# EAGLE schematic SzineszFeny_2mm_V12 (EAGLE 7.5.0)
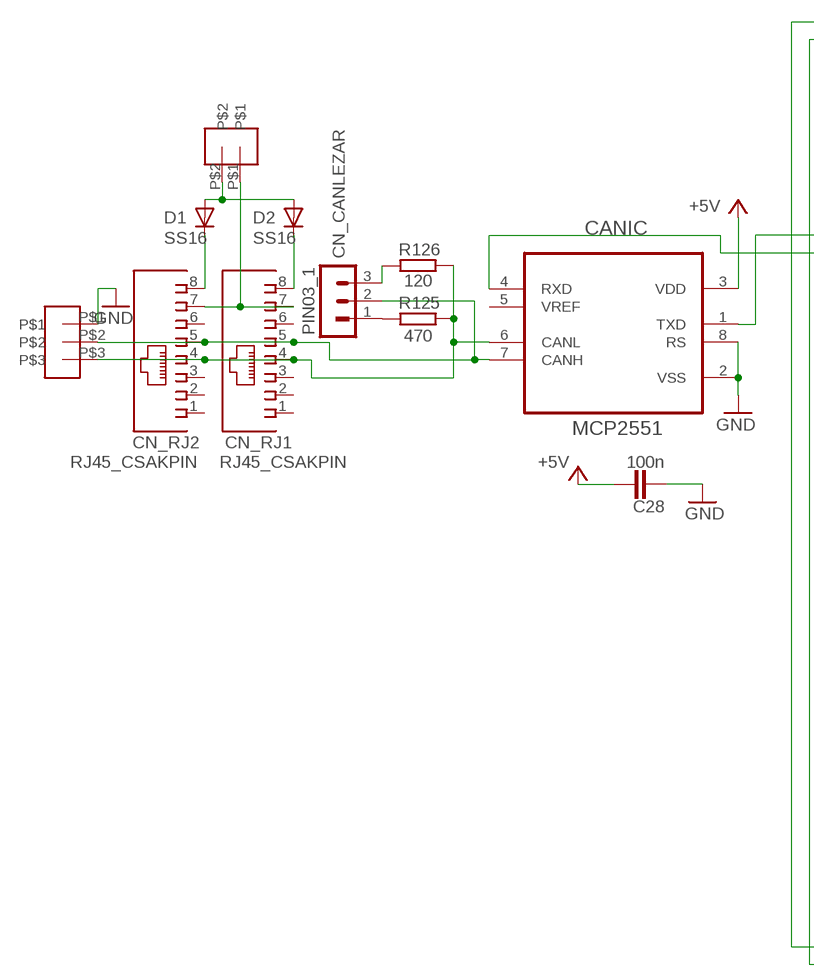
[diagram p0: schematic, sheet 1, part 1 of 2]
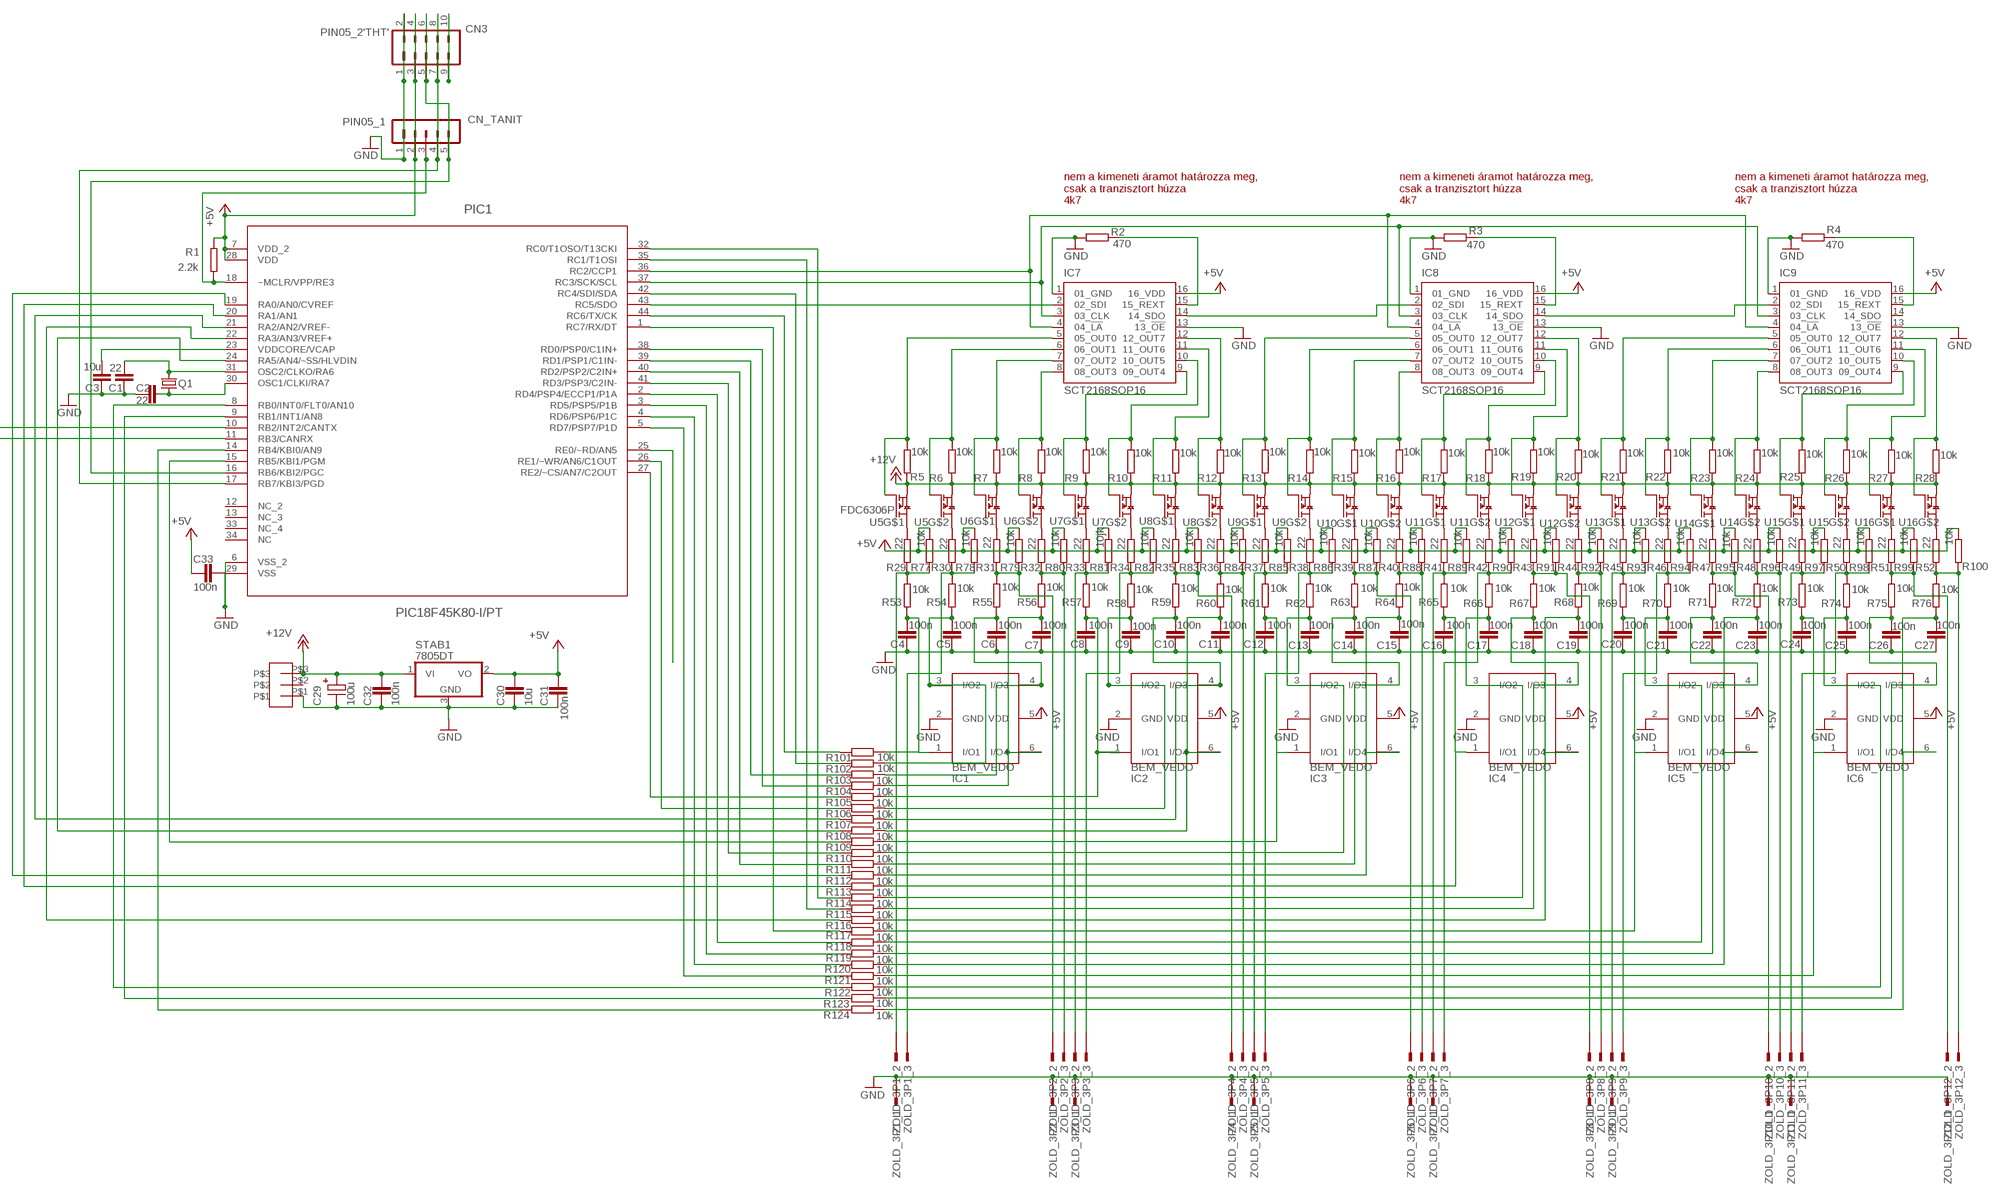
[diagram p1: schematic, sheet 1, part 2 of 2]

## Parts
C1  22  C0805  [R0805]
C2  22  C0805  [R0805]
C3  10u  C0805  [R0805]
C4  100n  C0805  [R0805]
C5  100n  C0805  [R0805]
C6  100n  C0805  [R0805]
C7  100n  C0805  [R0805]
C8  100n  C0805  [R0805]
C9  100n  C0805  [R0805]
C10  100n  C0805  [R0805]
C11  100n  C0805  [R0805]
C12  100n  C0805  [R0805]
C13  100n  C0805  [R0805]
C14  100n  C0805  [R0805]
C15  100n  C0805  [R0805]
C16  100n  C0805  [R0805]
C17  100n  C0805  [R0805]
C18  100n  C0805  [R0805]
C19  100n  C0805  [R0805]
C20  100n  C0805  [R0805]
C21  100n  C0805  [R0805]
C22  100n  C0805  [R0805]
C23  100n  C0805  [R0805]
C24  100n  C0805  [R0805]
C25  100n  C0805  [R0805]
C26  100n  C0805  [R0805]
C27  100n  C0805  [R0805]
C28  100n  C0805  [R0805]
C29  100u  C_EL1R07  [C_EL1RASZT07]
C30  10u  C0805  [R0805]
C31  100n  C0805  [R0805]
C32  100n  C0805  [R0805]
C33  100n  C0805  [R0805]
CANIC  MCP2551  MCP2551-I/P  [DIP254P762X432-8]
CN3  PIN05_2'THT'  [PIN05_2]
CN_CANLEZAR  PIN03_1  [PIN03_1]
CN_RJ1  RJ45_CSAKPIN  [RJ45_CSAKPIN]
CN_RJ2  RJ45_CSAKPIN  [RJ45_CSAKPIN]
CN_TANIT  PIN05_1  [PIN05_1]
D1  SS16  DDO214AC  [DO214AC]
D2  SS16  DDO214AC  [DO214AC]
IC1  BEM_VEDO  [TSOP-6]
IC2  BEM_VEDO  [TSOP-6]
IC3  BEM_VEDO  [TSOP-6]
IC4  BEM_VEDO  [TSOP-6]
IC5  BEM_VEDO  [TSOP-6]
IC6  BEM_VEDO  [TSOP-6]
IC7  SCT2168SOP16  [SO16]
IC8  SCT2168SOP16  [SO16]
IC9  SCT2168SOP16  [SO16]
PIC1  PIC18F45K80-I/PT  [QFP80P1200X1200X120-44N]
Q1  XTAL_2QS  [XTAL_QS]
R1  2.2k  R_EU0805  [R0805@1]
R2  470  R_EU0805  [R0805@1]
R3  470  R_EU0805  [R0805@1]
R4  470  R_EU0805  [R0805@1]
R5  10k  R_EU0805  [R0805@1]
R6  10k  R_EU0805  [R0805@1]
R7  10k  R_EU0805  [R0805@1]
R8  10k  R_EU0805  [R0805@1]
R9  10k  R_EU0805  [R0805@1]
R10  10k  R_EU0805  [R0805@1]
R11  10k  R_EU0805  [R0805@1]
R12  10k  R_EU0805  [R0805@1]
R13  10k  R_EU0805  [R0805@1]
R14  10k  R_EU0805  [R0805@1]
R15  10k  R_EU0805  [R0805@1]
R16  10k  R_EU0805  [R0805@1]
R17  10k  R_EU0805  [R0805@1]
R18  10k  R_EU0805  [R0805@1]
R19  10k  R_EU0805  [R0805@1]
R20  10k  R_EU0805  [R0805@1]
R21  10k  R_EU0805  [R0805@1]
R22  10k  R_EU0805  [R0805@1]
R23  10k  R_EU0805  [R0805@1]
R24  10k  R_EU0805  [R0805@1]
R25  10k  R_EU0805  [R0805@1]
R26  10k  R_EU0805  [R0805@1]
R27  10k  R_EU0805  [R0805@1]
R28  10k  R_EU0805  [R0805@1]
R29  22  R_EU0805  [R0805@1]
R30  22  R_EU0805  [R0805@1]
R31  22  R_EU0805  [R0805@1]
R32  22  R_EU0805  [R0805@1]
R33  22  R_EU0805  [R0805@1]
R34  22  R_EU0805  [R0805@1]
R35  22  R_EU0805  [R0805@1]
R36  22  R_EU0805  [R0805@1]
R37  22  R_EU0805  [R0805@1]
R38  22  R_EU0805  [R0805@1]
R39  22  R_EU0805  [R0805@1]
R40  22  R_EU0805  [R0805@1]
R41  22  R_EU0805  [R0805@1]
R42  22  R_EU0805  [R0805@1]
R43  22  R_EU0805  [R0805@1]
R44  22  R_EU0805  [R0805@1]
R45  22  R_EU0805  [R0805@1]
R46  22  R_EU0805  [R0805@1]
R47  22  R_EU0805  [R0805@1]
R48  22  R_EU0805  [R0805@1]
R49  22  R_EU0805  [R0805@1]
R50  22  R_EU0805  [R0805@1]
R51  22  R_EU0805  [R0805@1]
R52  22  R_EU0805  [R0805@1]
R53  10k  R_EU0805  [R0805@1]
R54  10k  R_EU0805  [R0805@1]
R55  10k  R_EU0805  [R0805@1]
R56  10k  R_EU0805  [R0805@1]
R57  10k  R_EU0805  [R0805@1]
R58  10k  R_EU0805  [R0805@1]
R59  10k  R_EU0805  [R0805@1]
R60  10k  R_EU0805  [R0805@1]
R61  10k  R_EU0805  [R0805@1]
R62  10k  R_EU0805  [R0805@1]
R63  10k  R_EU0805  [R0805@1]
R64  10k  R_EU0805  [R0805@1]
R65  10k  R_EU0805  [R0805@1]
R66  10k  R_EU0805  [R0805@1]
R67  10k  R_EU0805  [R0805@1]
R68  10k  R_EU0805  [R0805@1]
R69  10k  R_EU0805  [R0805@1]
R70  10k  R_EU0805  [R0805@1]
R71  10k  R_EU0805  [R0805@1]
R72  10k  R_EU0805  [R0805@1]
R73  10k  R_EU0805  [R0805@1]
R74  10k  R_EU0805  [R0805@1]
R75  10k  R_EU0805  [R0805@1]
R76  10k  R_EU0805  [R0805@1]
R77  10k  R_EU0805  [R0805@1]
R78  10k  R_EU0805  [R0805@1]
R79  10k  R_EU0805  [R0805@1]
R80  10k  R_EU0805  [R0805@1]
R81  10jk  R_EU0805  [R0805@1]
R82  10k  R_EU0805  [R0805@1]
R83  10k  R_EU0805  [R0805@1]
R84  10k  R_EU0805  [R0805@1]
R85  10k  R_EU0805  [R0805@1]
R86  10k  R_EU0805  [R0805@1]
R87  10k  R_EU0805  [R0805@1]
R88  10k  R_EU0805  [R0805@1]
R89  10k  R_EU0805  [R0805@1]
R90  10k  R_EU0805  [R0805@1]
R91  10k  R_EU0805  [R0805@1]
R92  10k  R_EU0805  [R0805@1]
R93  10k  R_EU0805  [R0805@1]
R94  10k  R_EU0805  [R0805@1]
R95  10k  R_EU0805  [R0805@1]
R96  10k  R_EU0805  [R0805@1]
R97  10k  R_EU0805  [R0805@1]
R98  10k  R_EU0805  [R0805@1]
R99  10k  R_EU0805  [R0805@1]
R100  10k  R_EU0805  [R0805@1]
R101  10k  R_EU0805  [R0805@1]
R102  10k  R_EU0805  [R0805@1]
R103  10k  R_EU0805  [R0805@1]
R104  10k  R_EU0805  [R0805@1]
R105  10k  R_EU0805  [R0805@1]
R106  10k  R_EU0805  [R0805@1]
R107  10k  R_EU0805  [R0805@1]
R108  10k  R_EU0805  [R0805@1]
R109  10k  R_EU0805  [R0805@1]
R110  10k  R_EU0805  [R0805@1]
R111  10k  R_EU0805  [R0805@1]
R112  10k  R_EU0805  [R0805@1]
R113  10k  R_EU0805  [R0805@1]
R114  10k  R_EU0805  [R0805@1]
R115  10k  R_EU0805  [R0805@1]
R116  10k  R_EU0805  [R0805@1]
R117  10k  R_EU0805  [R0805@1]
R118  10k  R_EU0805  [R0805@1]
R119  10k  R_EU0805  [R0805@1]
R120  10k  R_EU0805  [R0805@1]
R121  10k  R_EU0805  [R0805@1]
R122  10k  R_EU0805  [R0805@1]
R123  10k  R_EU0805  [R0805@1]
R124  10k  R_EU0805  [R0805@1]
R125  470  R_EU0805  [R0805@1]
R126  120  R_EU0805  [R0805@1]
STAB1  7805DT  [TO252]
U5  FDC6306P  AP2625GY-HF-3SOT26  [SOT26]
U6  AP2625GY-HF-3SOT26  [SOT26]
U7  AP2625GY-HF-3SOT26  [SOT26]
U8  AP2625GY-HF-3SOT26  [SOT26]
U9  AP2625GY-HF-3SOT26  [SOT26]
U10  AP2625GY-HF-3SOT26  [SOT26]
U11  AP2625GY-HF-3SOT26  [SOT26]
U12  AP2625GY-HF-3SOT26  [SOT26]
U13  AP2625GY-HF-3SOT26  [SOT26]
U14  AP2625GY-HF-3SOT26  [SOT26]
U15  AP2625GY-HF-3SOT26  [SOT26]
U16  FDC6306P  AP2625GY-HF-3SOT26  [SOT26]
U$1  FEHER_TUS_3  [FEHER_TUS_3]
U$20  FEHER_TUS_3  [FEHER_TUS_3]
U$21  FEHER_TUS_2ALLO  [FEHER_TUS_2]
ZOLD_3P1  ZOLD_KICSI_3P  [ZOLD_KICSI_3P]
ZOLD_3P2  ZOLD_KICSI_3P  [ZOLD_KICSI_3P]
ZOLD_3P3  ZOLD_KICSI_3P  [ZOLD_KICSI_3P]
ZOLD_3P4  ZOLD_KICSI_3P  [ZOLD_KICSI_3P]
ZOLD_3P5  ZOLD_KICSI_3P  [ZOLD_KICSI_3P]
ZOLD_3P6  ZOLD_KICSI_3P  [ZOLD_KICSI_3P]
ZOLD_3P7  ZOLD_KICSI_3P  [ZOLD_KICSI_3P]
ZOLD_3P8  ZOLD_KICSI_3P  [ZOLD_KICSI_3P]
ZOLD_3P9  ZOLD_KICSI_3P  [ZOLD_KICSI_3P]
ZOLD_3P10  ZOLD_KICSI_3P  [ZOLD_KICSI_3P]
ZOLD_3P11  ZOLD_KICSI_3P  [ZOLD_KICSI_3P]
ZOLD_3P12  ZOLD_KICSI_3P  [ZOLD_KICSI_3P]

## Nets
+5V: C28.1 C30.1 C31.1 C33.2 CANIC.3(VDD) CN3.3 CN3.4 CN_TANIT.2 IC1.5(VDD) IC2.5(VDD) IC3.5(VDD) IC4.5(VDD) IC5.5(VDD) IC6.5(VDD) IC7.16(16_VDD) IC8.16(16_VDD) IC9.16(16_VDD) PIC1.7(VDD_2) PIC1.28(VDD) R1.2(E) R77.1(A) R78.1(A) R79.1(A) R80.1(A) R81.1(A) R82.1(A) R83.1(A) R84.1(A) R85.1(A) R86.1(A) R87.1(A) R88.1(A) R89.1(A) R90.1(A) R91.1(A) R92.1(A) R93.1(A) R94.1(A) R95.1(A) R96.1(A) R97.1(A) R98.1(A) R99.1(A) R100.1(A) STAB1.2(VO)
+12V: C29.P+ C32.1 R5.1(A) R6.1(A) R7.1(A) R8.1(A) R9.1(A) R10.1(A) R11.1(A) R12.1(A) R13.1(A) R14.1(A) R15.1(A) R16.1(A) R17.1(A) R18.1(A) R19.1(A) R20.1(A) R21.1(A) R22.1(A) R23.1(A) R24.1(A) R25.1(A) R26.1(A) R27.1(A) R28.1(A) STAB1.1(VI) U5.P$2(S) U5.P$5(S) U6.P$2(S) U6.P$5(S) U7.P$2(S) U7.P$5(S) U8.P$2(S) U8.P$5(S) U9.P$2(S) U9.P$5(S) U10.P$2(S) U10.P$5(S) U11.P$2(S) U11.P$5(S) U12.P$2(S) U12.P$5(S) U13.P$2(S) U13.P$5(S) U14.P$2(S) U14.P$5(S) U15.P$2(S) U15.P$5(S) U16.P$2(S) U16.P$5(S) U$20.P$3
GND: C1.2 C2.2 C3.2 C4.2 C5.2 C6.2 C7.2 C8.2 C9.2 C10.2 C11.2 C12.2 C13.2 C14.2 C15.2 C16.2 C17.2 C18.2 C19.2 C20.2 C21.2 C22.2 C23.2 C24.2 C25.2 C26.2 C27.2 C28.2 C29.P- C30.2 C31.2 C32.2 C33.1 CANIC.2(VSS) CANIC.8(RS) CN3.1 CN3.2 CN_TANIT.1 IC1.2(GND) IC2.2(GND) IC3.2(GND) IC4.2(GND) IC5.2(GND) IC6.2(GND) IC7.1(01_GND) IC7.13(13_!OE!) IC8.1(01_GND) IC8.13(13_!OE!) IC9.1(01_GND) IC9.13(13_!OE!) PIC1.6(VSS_2) PIC1.29(VSS) R2.1(A) R3.1(A) R4.1(A) STAB1.3(GND) U$1.P$1 U$20.P$1 ZOLD_3P1.1 ZOLD_3P2.1 ZOLD_3P3.1 ZOLD_3P4.1 ZOLD_3P5.1 ZOLD_3P6.1 ZOLD_3P7.1 ZOLD_3P8.1 ZOLD_3P9.1 ZOLD_3P10.1 ZOLD_3P11.1 ZOLD_3P12.1
N$1: C3.1 PIC1.23(VDDCORE/VCAP)
N$2: CN_TANIT.3 PIC1.18(~MCLR/VPP/RE3) R1.1(A)
N$3: CN3.7 CN3.8 CN_TANIT.4 PIC1.17(RB7/KBI3/PGD)
N$4: IC7.14(14_SDO) IC8.2(02_SDI)
N$5: C1.1 PIC1.31(OSC2/CLKO/RA6) Q1.2
N$6: C2.1 PIC1.30(OSC1/CLKI/RA7) Q1.1
N$7: PIC1.19(RA0/AN0/CVREF) R112.1(A)
N$8: PIC1.20(RA1/AN1) R113.1(A)
N$9: PIC1.22(RA3/AN3/VREF+) R116.1(A)
N$10: PIC1.21(RA2/AN2/VREF-) R107.1(A)
N$11: PIC1.24(RA5/AN4/~SS/HLVDIN) R108.1(A)
N$12: IC8.7(07_OUT2) R15.2(E) U10.P$1(G)
N$13: IC7.6(06_OUT1) R6.2(E) U5.P$3(G)
N$14: IC9.5(05_OUT0) R21.2(E) U13.P$1(G)
N$15: IC8.15(15_REXT) R3.2(E)
N$16: IC8.5(05_OUT0) R13.2(E) U9.P$1(G)
N$17: IC7.3(03_CLK) IC8.3(03_CLK) IC9.3(03_CLK) PIC1.37(RC3/SCK/SCL)
N$18: IC7.4(04_!LA!) IC8.4(04_!LA!) IC9.4(04_!LA!) PIC1.36(RC2/CCP1)
N$19: IC9.6(06_OUT1) R22.2(E) U13.P$3(G)
N$20: IC9.7(07_OUT2) R23.2(E) U14.P$1(G)
N$21: IC7.8(08_OUT3) R8.2(E) U6.P$3(G)
N$22: IC9.15(15_REXT) R4.2(E)
N$23: CN_CANLEZAR.1 R125.2(E)
N$24: IC9.8(08_OUT3) R24.2(E) U14.P$3(G)
N$25: IC8.6(06_OUT1) R14.2(E) U9.P$3(G)
N$26: IC7.5(05_OUT0) R5.2(E) U5.P$1(G)
N$27: IC7.7(07_OUT2) R7.2(E) U6.P$1(G)
N$28: IC8.8(08_OUT3) R16.2(E) U10.P$3(G)
N$29: IC9.9(09_OUT4) R25.2(E) U15.P$1(G)
N$30: IC8.9(09_OUT4) R17.2(E) U11.P$1(G)
N$31: IC9.10(10_OUT5) R26.2(E) U15.P$3(G)
N$32: IC8.10(10_OUT5) R18.2(E) U11.P$3(G)
N$33: IC7.9(09_OUT4) R9.2(E) U7.P$1(G)
N$34: IC9.11(11_OUT6) R27.2(E) U16.P$1(G)
N$35: IC8.11(11_OUT6) R19.2(E) U12.P$1(G)
N$36: IC8.12(12_OUT7) R20.2(E) U12.P$3(G)
N$37: IC7.10(10_OUT5) R10.2(E) U7.P$3(G)
N$38: IC7.11(11_OUT6) R11.2(E) U8.P$1(G)
N$39: IC7.12(12_OUT7) R12.2(E) U8.P$3(G)
N$40: IC9.12(12_OUT7) R28.2(E) U16.P$3(G)
N$41: R29.2(E) U5.P$6(D)
N$42: R30.2(E) U5.P$4(D)
N$43: R31.2(E) U6.P$6(D)
N$44: R32.2(E) U6.P$4(D)
N$45: R33.2(E) U7.P$6(D)
N$46: R34.2(E) U7.P$4(D)
N$47: R35.2(E) U8.P$6(D)
N$48: R36.2(E) U8.P$4(D)
N$49: R37.2(E) U9.P$6(D)
N$50: R38.2(E) U9.P$4(D)
N$51: R39.2(E) U10.P$6(D)
N$52: R40.2(E) U10.P$4(D)
N$53: R41.2(E) U11.P$6(D)
N$54: R42.2(E) U11.P$4(D)
N$55: R43.2(E) U12.P$6(D)
N$56: R44.2(E) U12.P$4(D)
N$57: R45.2(E) U13.P$6(D)
N$58: R46.2(E) U13.P$4(D)
N$59: R47.2(E) U14.P$6(D)
N$60: R48.2(E) U14.P$4(D)
N$61: R49.2(E) U15.P$6(D)
N$62: R50.2(E) U15.P$4(D)
N$63: IC7.2(02_SDI) PIC1.43(RC5/SDO)
N$64: R51.2(E) U16.P$6(D)
N$65: R52.2(E) U16.P$4(D)
N$66: CN3.5 CN3.6 CN_TANIT.5 PIC1.16(RB6/KBI2/PGC)
N$67: PIC1.27(RE2/~CS/AN7/C2OUT) R105.1(A)
N$68: R31.1(A) R55.2(E) R79.2(E) ZOLD_3P2.2
N$69: R32.1(A) R56.2(E) R80.2(E) ZOLD_3P2.3
N$70: R33.1(A) R57.2(E) R81.2(E) ZOLD_3P3.2
N$71: PIC1.26(RE1/~WR/AN6/C1OUT) R106.1(A)
N$72: R35.1(A) R59.2(E) R83.2(E) ZOLD_3P4.2
N$73: R36.1(A) R60.2(E) R84.2(E) ZOLD_3P4.3
N$74: R37.1(A) R61.2(E) R85.2(E) ZOLD_3P5.2
N$75: R38.1(A) R62.2(E) R86.2(E) ZOLD_3P5.3
N$76: R39.1(A) R63.2(E) R87.2(E) ZOLD_3P6.2
N$77: R40.1(A) R64.2(E) R88.2(E) ZOLD_3P6.3
N$78: R41.1(A) R65.2(E) R89.2(E) ZOLD_3P7.2
N$79: R42.1(A) R66.2(E) R90.2(E) ZOLD_3P7.3
N$80: R43.1(A) R67.2(E) R91.2(E) ZOLD_3P8.2
N$81: R44.1(A) R68.2(E) R92.2(E) ZOLD_3P8.3
N$82: R45.1(A) R69.2(E) R93.2(E) ZOLD_3P9.2
N$83: R46.1(A) R70.2(E) R94.2(E) ZOLD_3P9.3
N$84: R47.1(A) R71.2(E) R95.2(E) ZOLD_3P10.2
N$85: R48.1(A) R72.2(E) R96.2(E) ZOLD_3P10.3
N$86: R49.1(A) R73.2(E) R97.2(E) ZOLD_3P11.2
N$87: IC7.15(15_REXT) R2.2(E)
N$88: R50.1(A) R74.2(E) R98.2(E) ZOLD_3P11.3
N$89: R51.1(A) R75.2(E) R99.2(E) ZOLD_3P12.2
N$90: R52.1(A) R76.2(E) R100.2(E) ZOLD_3P12.3
N$91: C4.1 IC1.1(I/O1) R53.1(A) R101.2(E)
N$92: R29.1(A) R53.2(E) R77.2(E) ZOLD_3P1.2
N$93: C5.1 IC1.3(I/O2) R54.1(A) R102.2(E)
N$94: C6.1 IC1.4(I/O3) R55.1(A) R103.2(E)
N$95: C7.1 IC1.6(I/O4) R56.1(A) R104.2(E)
N$96: C11.1 IC2.6(I/O4) R60.1(A) R108.2(E)
N$97: R34.1(A) R58.2(E) R82.2(E) ZOLD_3P3.3
N$98: C8.1 IC2.1(I/O1) R57.1(A) R105.2(E)
N$99: CANIC.6(CANL) CN_RJ1.4 CN_RJ2.4 R125.1(A) R126.2(E) U$1.P$3
N$100: C12.1 IC3.1(I/O1) R61.1(A) R109.2(E)
N$101: C13.1 IC3.3(I/O2) R62.1(A) R110.2(E)
N$102: C17.1 IC4.3(I/O2) R66.1(A) R114.2(E)
N$103: C15.1 IC3.6(I/O4) R64.1(A) R112.2(E)
N$104: C16.1 IC4.1(I/O1) R65.1(A) R113.2(E)
N$105: R30.1(A) R54.2(E) R78.2(E) ZOLD_3P1.3
N$106: C18.1 IC4.4(I/O3) R67.1(A) R115.2(E)
N$107: C19.1 IC4.6(I/O4) R68.1(A) R116.2(E)
N$108: C20.1 IC5.1(I/O1) R69.1(A) R117.2(E)
N$109: C21.1 IC5.3(I/O2) R70.1(A) R118.2(E)
N$110: C22.1 IC5.4(I/O3) R71.1(A) R119.2(E)
N$111: C23.1 IC5.6(I/O4) R72.1(A) R120.2(E)
N$112: C24.1 IC6.1(I/O1) R73.1(A) R121.2(E)
N$113: C25.1 IC6.3(I/O2) R74.1(A) R122.2(E)
N$114: C26.1 IC6.4(I/O3) R75.1(A) R123.2(E)
N$115: C27.1 IC6.6(I/O4) R76.1(A) R124.2(E)
N$116: PIC1.25(RE0/~RD/AN5)
N$117: PIC1.5(RD7/PSP7/P1D) R121.1(A)
N$118: PIC1.4(RD6/PSP6/P1C) R120.1(A)
N$119: C14.1 IC3.4(I/O3) R63.1(A) R111.2(E)
N$120: PIC1.3(RD5/PSP5/P1B) R119.1(A)
N$121: PIC1.2(RD4/PSP4/ECCP1/P1A) R118.1(A)
N$122: PIC1.41(RD3/PSP3/C2IN-) R110.1(A)
N$123: PIC1.40(RD2/PSP2/C2IN+) R111.1(A)
N$124: PIC1.39(RD1/PSP1/C1IN-) R103.1(A)
N$125: PIC1.38(RD0/PSP0/C1IN+) R104.1(A)
N$126: PIC1.1(RC7/RX/DT) R117.1(A)
N$127: PIC1.44(RC6/TX/CK) R101.1(A)
N$128: PIC1.42(RC4/SDI/SDA) R102.1(A)
N$129: PIC1.35(RC1/T1OSI) R115.1(A)
N$130: PIC1.32(RC0/T1OSO/T13CKI) R114.1(A)
N$131: CANIC.7(CANH) CN_CANLEZAR.2 CN_RJ1.5 CN_RJ2.5 U$1.P$2
N$132: CANIC.1(TXD) PIC1.10(RB2/INT2/CANTX)
N$133: C10.1 IC2.4(I/O3) R59.1(A) R107.2(E)
N$134: C9.1 IC2.3(I/O2) R58.1(A) R106.2(E)
N$135: PIC1.15(RB5/KBI1/PGM) R109.1(A)
N$136: PIC1.14(RB4/KBI0/AN9) R124.1(A)
N$137: CANIC.4(RXD) PIC1.11(RB3/CANRX)
N$138: CN_CANLEZAR.3 R126.1(A)
N$139: PIC1.9(RB1/INT1/AN8) R123.1(A)
N$140: PIC1.8(RB0/INT0/FLT0/AN10) R122.1(A)
N$141: CN3.9 CN3.10
N$143: IC8.14(14_SDO) IC9.2(02_SDI)
N$144: CN_RJ2.8 D1.C
N$145: CN_RJ1.7 CN_RJ2.7 U$21.P$1
N$146: D1.A D2.A U$21.P$2
N$147: CN_RJ1.8 D2.C
Unconnected: CANIC.5(VREF) CN_RJ1.1 CN_RJ1.2 CN_RJ1.3 CN_RJ1.6 CN_RJ2.1 CN_RJ2.2 CN_RJ2.3 CN_RJ2.6 IC9.14(14_SDO) PIC1.12(NC_2) PIC1.13(NC_3) PIC1.33(NC_4) PIC1.34(NC) U$20.P$2

## Notes on the sheet
- nem a kimeneti áramot határozza meg,
  csak a tranzisztort húzza
  4k7
- nem a kimeneti áramot határozza meg,
  csak a tranzisztort húzza
  4k7
- nem a kimeneti áramot határozza meg,
  csak a tranzisztort húzza
  4k7

## Library data of the parts
C1-C28 C30-C33 = Cf_RLCPX:C
C29 = Cf_RLCPX:C_EL
CANIC = Microchip_By_element14_Batch_1:MCP2551-I/P: High-Speed CAN Transceiver; DESCRIPTION: CAN CTRL; MPN: MCP2551-I/P; OC_FARNELL: 1292240; OC_NEWARK: 61K2947; PACKAGE: PDIP-8; SUPPLIER: Microchip
CN3 = Cf_Csatl:PIN05_2
CN_CANLEZAR = Cf_Csatl:PIN03_1
CN_RJ1 CN_RJ2 = narval:RJ45_CSAKPIN
CN_TANIT = Cf_Csatl:PIN05_1
D1 = Cf_Felv:D; D1: SS16
D2 = Cf_Felv:D; D2: SS16
IC1-IC6 = narval:BEM_VEDO
IC7-IC9 = Cf_IC:SCT2168
PIC1 = narval:PIC18F45K80-I/PT: Enhanced Flash Microcontrollers; DESCRIPTION: 8BIT MCU; MPN: PIC18F4580-I/PT; OC_FARNELL: 1528449; OC_NEWARK: 71J7258; PACKAGE: TQFP-44; SUPPLIER: Microchip
Q1 = Cf_RLCPX:XTAL_2
R1-R126 = Cf_RLCPX:R_EU
STAB1 = linear:78*: Positive VOLTAGE REGULATOR Source: http://cache.national.com/ds/LM/LM78L05.pdf http://www.fairchildsemi.com/ds/LM/LM7805.pdf
U5-U16 = narval:AP2625GY-HF-3
U$1 U$20 = csatik:FEHER_TUS_3
U$21 = csatik:FEHER_TUS_2
ZOLD_3P1-ZOLD_3P12 = narval:ZOLD_KICSI_3P

## Net classes
0 default: width 0.305 mm, clearance 0.178 mm
1 Tap: width 0.406 mm, clearance 0.178 mm